# Altium schematic sheet ESP8266_IR_PZEM.SchDoc
size A4
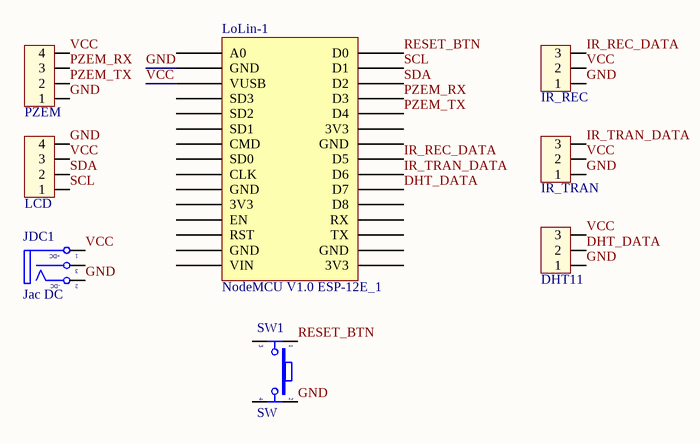
[diagram p0: ESP8266_IR_PZEM.SchDoc]

## Parts
JDC1  Jac DC  [DC-IN]
JP1  LCD  [CON4]
JP2  IR_REC  [CON3]
JP3  IR_TRAN  [CON3]
JP4  DHT11  [CON3]
JP5  PZEM  [CON4]
LoLin-1  NodeMCU V1.0 ESP-12E_1  [LoLin NodeMcu V3]
SW1  SW  [SW4]

## Nets
DHT_DATA: JP4.2 LoLin-1.D7
GND: JDC1.2(TN) JP1.4 JP2.1 JP3.1 JP4.1 JP5.1 LoLin-1.GND SW1.2
IR_REC_DATA: JP2.3 LoLin-1.D5
IR_TRAN_DATA: JP3.3 LoLin-1.D6
PZEM_RX: JP5.3 LoLin-1.D3
PZEM_TX: JP5.2 LoLin-1.D4
RESET_BTN: LoLin-1.D0 SW1.1
SCL: JP1.1 LoLin-1.D1
SDA: JP1.2 LoLin-1.D2
VCC: JDC1.1(T) JP1.3 JP2.2 JP3.2 JP4.3 JP5.4 LoLin-1.VUSB

Not connected (* = marked no-connect by the designer): JDC1 3(S); LoLin-1 3V3 A0 CLK CMD D8 EN RST RX SD0 SD1 SD2 SD3 TX VIN; SW1 3 4

## Notes on the sheet
- (in symbol DCIN) +DC; -DC

## Library data of the parts
JDC1 = DCIN: Jac DC input; Value: Jac DC
JP1 JP5 = Con4: Connector 4; Value: Connector 4
JP2-JP4 = Con3: Connector 3; Value: Connector 3
LoLin-1 = NodeMCU V1.0 ESP-12E_1: LoLin NodeMCU V3
SW1 = SW4: Switch button 4 pin; Value: Button chip 4 pin